# Altium schematic sheet WindSpeed.SchDoc
size A4
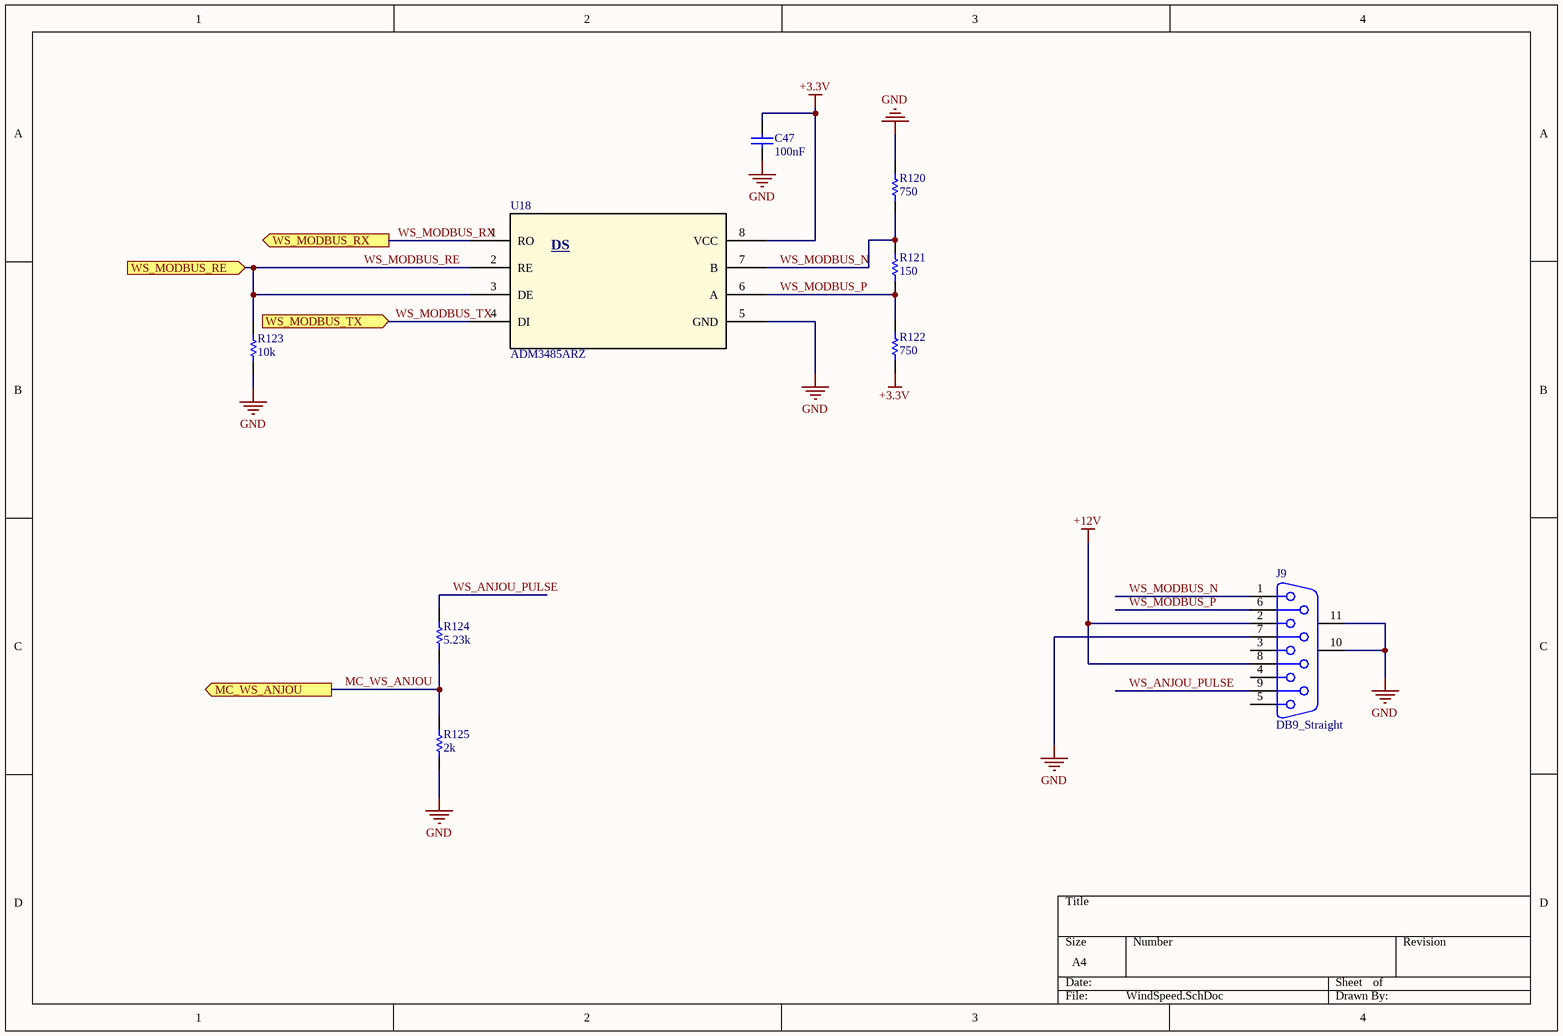
[diagram p0: WindSpeed.SchDoc]

## Parts
C47  value 100nF  [C-805]  (hidden comment: C-805)
J9  DB9_Straight  [DB9_Straight]
R120  value 750  [R-805]  (hidden comment: R-805)
R121  value 150  [R-805]  (hidden comment: R-805)
R122  value 750  [R-805]  (hidden comment: R-805)
R123  value 10k  [R-805]  (hidden comment: R-805)
R124  value 5.23k  [R-805]  (hidden comment: R-805)
R125  value 2k  [R-805]  (hidden comment: R-805)
U18  ADM3485ARZ  [R_8]

## Ports
MC_WS_ANJOU (out), WS_MODBUS_RE (in), WS_MODBUS_RX (out), WS_MODBUS_TX (in)

## Nets
+3.3V: C47.2 R122.1 U18.8(VCC)
+12V: J9.2 J9.8
GND: C47.1 J9.7 J9.10(MH1) J9.11(MH2) R120.2 R123.1 R125.1 U18.5(GND)
MC_WS_ANJOU: R124.1 R125.2 ; port MC_WS_ANJOU
WS_ANJOU_PULSE: J9.9 R124.2
WS_MODBUS_N: J9.1 R120.1 R121.2 U18.7(B)
WS_MODBUS_P: J9.6 R121.1 R122.2 U18.6(A)
WS_MODBUS_RE: R123.2 U18.2(RE) U18.3(DE) ; port WS_MODBUS_RE
WS_MODBUS_RX: U18.1(RO) ; port WS_MODBUS_RX
WS_MODBUS_TX: U18.4(DI) ; port WS_MODBUS_TX

Not connected (* = marked no-connect by the designer): J9 3 4 5

## Notes on the sheet
- (in symbol ADM3485ARZ) DS

## Library data of the parts
C47 = C-805: Capacitor; Published: 8-Jun-2000; LatestRevisionDate: 29-May-2009; LatestRevisionNote: IPC-7351 Footprint Added.; PackageReference: C1206; Publisher: Altium Limited; PackageDescription: Chip Capacitor
J9 = DB9_Straight: Receptacle Assembly, 9 Position, Right Angle; PackageDocument: O; Positions: 9; Published: 15-Jun-2001; LatestRevisionDate: 17-Jul-2002; LatestRevisionNote: Re-released for DXP Platform.; DatasheetDocument: 1-Sep-1999; PackageReference: 788750; Publisher: Altium Limited; Orientation: Right Angle; Gender: Receptacle
R120-R125 = R-805: Resistor
U18 = ADM3485ARZ: No Description Available; Vendor: Analog Devices Inc; Built_By: EMA_UL_Team; Manufacturer_Part_Number: ADM3485ARZ; Copyright: Copyright (C) 2018 Accelerated Designs. All rights reserved; RefDes: RefDes; Type: DEV; Value: Value